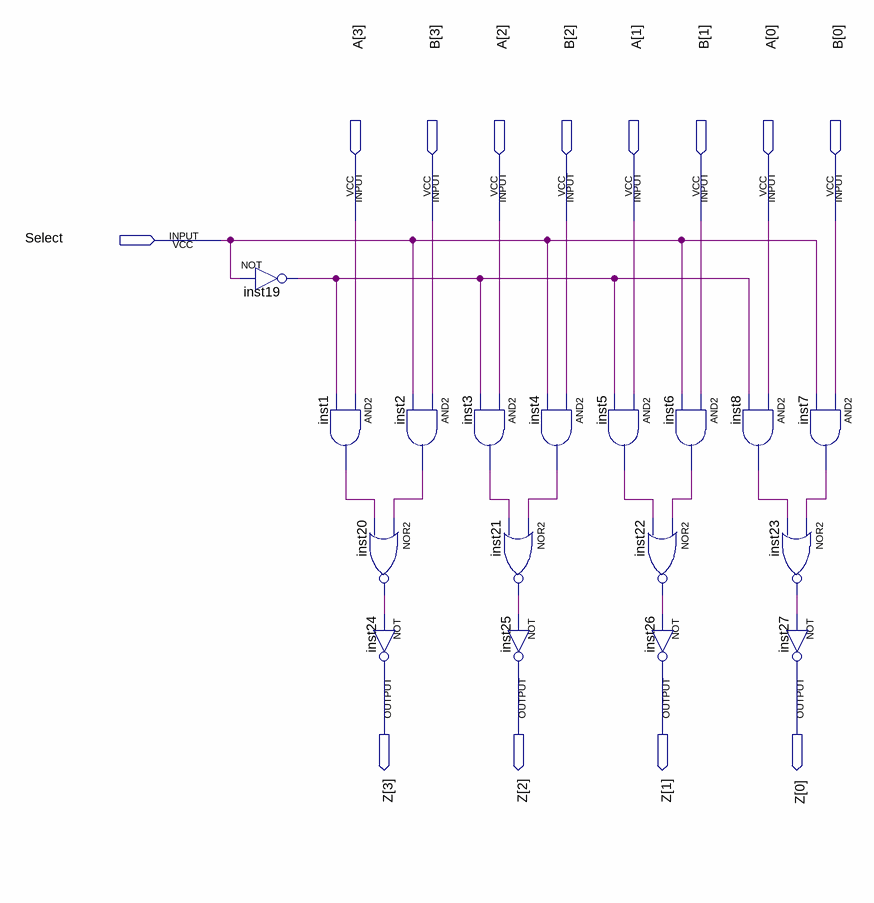
[diagram p0: schematic sheet]
// Quartus schematic MUX.bdf as structural Verilog: 17 symbols, 13 pins
module MUX (
  input  [3:0] A,
  input  [3:0] B,
  input  Select,
  output [3:0] Z
);

  wire inst1_out, inst2_out, inst3_out, inst4_out, inst5_out, inst6_out, inst7_out, inst8_out, inst19_out,
       inst20_out, inst21_out, inst22_out, inst23_out;

  not inst19 (inst19_out, Select);
  and inst1 (inst1_out, A[3], inst19_out);
  nor inst20 (inst20_out, inst2_out, inst1_out);
  not inst24 (Z[3], inst20_out);
  and inst2 (inst2_out, B[3], Select);
  and inst3 (inst3_out, A[2], inst19_out);
  and inst4 (inst4_out, B[2], Select);
  nor inst21 (inst21_out, inst4_out, inst3_out);
  not inst25 (Z[2], inst21_out);
  and inst5 (inst5_out, A[1], inst19_out);
  and inst6 (inst6_out, B[1], Select);
  nor inst22 (inst22_out, inst6_out, inst5_out);
  not inst26 (Z[1], inst22_out);
  and inst8 (inst8_out, A[0], inst19_out);
  nor inst23 (inst23_out, inst7_out, inst8_out);
  and inst7 (inst7_out, B[0], Select);
  not inst27 (Z[0], inst23_out);
endmodule
